# EAGLE design LEDARRAYLOW (EAGLE 8.6.0)
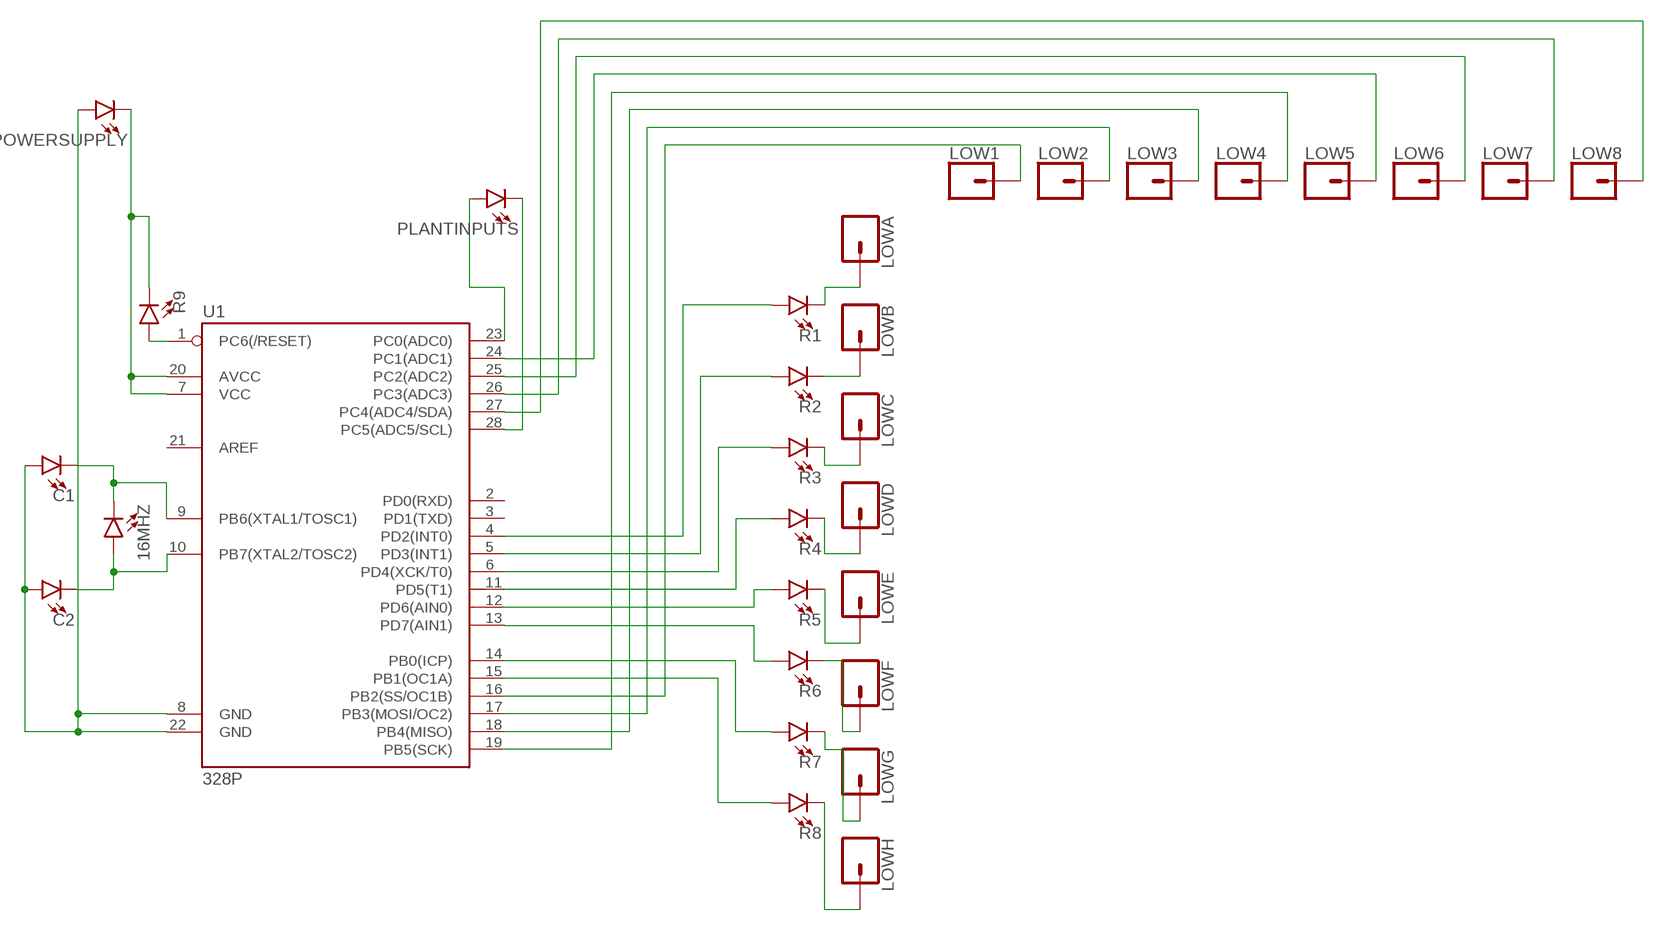
[diagram p0: schematic, sheet 1]

## Parts
16MHZ  LED3MM  [LED_3MM]
C1  LED3MM  [LED_3MM]
C2  LED3MM  [LED_3MM]
LOW1  CONN_01PTH_NO_SILK_KIT  [1X01NS_KIT]
LOW2  CONN_01PTH_NO_SILK_KIT  [1X01NS_KIT]
LOW3  CONN_01PTH_NO_SILK_KIT  [1X01NS_KIT]
LOW4  CONN_01PTH_NO_SILK_KIT  [1X01NS_KIT]
LOW5  CONN_01PTH_NO_SILK_KIT  [1X01NS_KIT]
LOW6  CONN_01PTH_NO_SILK_KIT  [1X01NS_KIT]
LOW7  CONN_01PTH_NO_SILK_KIT  [1X01NS_KIT]
LOW8  CONN_01PTH_NO_SILK_KIT  [1X01NS_KIT]
LOWA  CONN_01PTH_NO_SILK_KIT  [1X01NS_KIT]
LOWB  CONN_01PTH_NO_SILK_KIT  [1X01NS_KIT]
LOWC  CONN_01PTH_NO_SILK_KIT  [1X01NS_KIT]
LOWD  CONN_01PTH_NO_SILK_KIT  [1X01NS_KIT]
LOWE  CONN_01PTH_NO_SILK_KIT  [1X01NS_KIT]
LOWF  CONN_01PTH_NO_SILK_KIT  [1X01NS_KIT]
LOWG  CONN_01PTH_NO_SILK_KIT  [1X01NS_KIT]
LOWH  CONN_01PTH_NO_SILK_KIT  [1X01NS_KIT]
PLANTINPUTS  LED3MM  [LED_3MM]
POWERSUPPLY  LED3MM  [LED_3MM]
R1  LED3MM  [LED_3MM]
R2  LED3MM  [LED_3MM]
R3  LED3MM  [LED_3MM]
R4  LED3MM  [LED_3MM]
R5  LED3MM  [LED_3MM]
R6  LED3MM  [LED_3MM]
R7  LED3MM  [LED_3MM]
R8  LED3MM  [LED_3MM]
R9  LED3MM  [LED_3MM]
U1  328P  ATMEGA328P_PDIP  [DIP28]

## Nets
LEDD1: LOW1.1 U1.16(PB2(SS/OC1B))
N$1: R8.A U1.15(PB1(OC1A))
N$6: LOWD.1 R4.K(C)
N$7: R6.A U1.13(PD7(AIN1))
N$8: LOW6.1 U1.25(PC2(ADC2))
N$9: LOW2.1 U1.17(PB3(MOSI/OC2))
N$10: R7.A U1.14(PB0(ICP))
N$11: LOW3.1 U1.18(PB4(MISO))
N$13: PLANTINPUTS.A U1.23(PC0(ADC0))
N$14: LOW5.1 U1.24(PC1(ADC1))
N$16: 16MHZ.K(C) C1.K(C) U1.9(PB6(XTAL1/TOSC1))
N$17: R9.A U1.1(PC6(/RESET))
N$18: R5.A U1.12(PD6(AIN0))
N$19: R4.A U1.11(PD5(T1))
N$20: LOW7.1 U1.26(PC3(ADC3))
N$22: LOW8.1 U1.27(PC4(ADC4/SDA))
N$23: R2.A U1.5(PD3(INT1))
N$24: R1.A U1.4(PD2(INT0))
N$25: PLANTINPUTS.K(C) U1.28(PC5(ADC5/SCL))
N$26: POWERSUPPLY.K(C) R9.K(C) U1.7(VCC) U1.20(AVCC)
N$27: LOW4.1 U1.19(PB5(SCK))
N$28: 16MHZ.A C2.K(C) U1.10(PB7(XTAL2/TOSC2))
N$29: LOWC.1 R3.K(C)
N$30: R3.A U1.6(PD4(XCK/T0))
N$31: LOWB.1 R2.K(C)
N$33: LOWA.1 R1.K(C)
N$34: LOWE.1 R5.K(C)
N$35: LOWF.1 R6.K(C)
N$36: LOWG.1 R7.K(C)
N$37: LOWH.1 R8.K(C)
POWERSUPPLY: C1.A C2.A POWERSUPPLY.A U1.8(GND) U1.22(GND)
Unconnected: U1.2(PD0(RXD)) U1.3(PD1(TXD)) U1.21(AREF)

## Library data of the parts
16MHZ C1 C2 PLANTINPUTS POWERSUPPLY R1-R9 = SparkFun-LED:LED: LED (Generic) Standard schematic elements and footprints for 5mm, 3mm, 1206, and 0603 sized LEDs. Generic LEDs with no color specified.; PROD_ID: DIO-08794
LOW1-LOW8 LOWA LOWB LOWC LOWD LOWE LOWF LOWG LOWH = SparkFun-Connectors:CONN_01: Single connection point. Often used as Generic Header-pin footprint for 0.1 inch spaced/style header connections On any of the 0.1 inch spaced packages, you can populate with these: Break Away Headers - Straight <https://www.sparkfun.com/products/116> (PRT-00116) Break Away Male Headers - Right Angle <https://www.sparkfun.com/products/553> (PRT-00553) Female Headers <https://www.sparkfun.com/products/115> (PRT-00115) Break Away Headers - Machine Pin <https://www.sparkfun.com/products/117> (PRT-00117) Break Away Female Headers - Swiss Machine Pin <https://www.sparkfun.com/products/743> (PRT-00743) This device is also useful as a general connection point to wire up your design to another part of your project. Our various solder wires solder well into these plated through hole pads. Hook-Up Wire - Assortment (Stranded, 22 AWG) <https://www.sparkfun.com/products/11375> (PRT-11375) Hook-Up Wire - Assortment (Solid Core, 22 AWG) <https://www.sparkfun.com/products/11367> (PRT-11367) View the entire wire category on our website here <https://www.sparkfun.com/categories/141> Special notes: SMTSO-256-ET is a "flush mount" nut for a 4-40 screw. We mostly use this on specialty testbeds; it is a nice way to connect hardware to your PCB at an adjustable hieght. Also note, the SNAP packages are for using a snappable style connector. We sell a baggie of snaps and they are also used on two LilyPad designs: Snap Assortment - 30 pack (male and female) <https://www.sparkfun.com/products/11347> (DEV-11347) LilyPad Arduino SimpleSnap <https://www.sparkfun.com/products/10941> (DEV-10941) LilyPad SimpleSnap Protoboard <https://www.sparkfun.com/products/10940> (DEV-10940)
U1 = SparkFun-IC-Microcontroller:ATMEGA328P_PDIP: Atmel 328P Through hole ATMEGA328P uC used in the Arduino 32kb flash, 1k EEPROM, 2k SRAM Datasheet <http://www.sparkfun.com/datasheets/Components/SMD/ATMega328.pdf> SparkFun Products Storefront component: AVR 28 Pin 20MHz 32K 6A/D - ATMega328P <https://www.sparkfun.com/products/9061> (COM-09061) SparkFun Simon Says - Through-Hole Soldering Kit <https://www.sparkfun.com/products/10547> (KIT-10547) SparkFun Learn to Solder - Simon Says <https://www.sparkfun.com/products/13708> (KIT-13708) SparkFun BigTime Watch Kit <https://www.sparkfun.com/products/11734> (KIT-11734) SparkFun ClockIt <https://www.sparkfun.com/products/10930> (KIT-10930) SparkFun Serial Enabled LCD Kit <https://www.sparkfun.com/products/10097> (LCD-10097) SparkFun Simon Tilts - Through Hole Soldering Kit <https://www.sparkfun.com/products/12634> (KIT-12634) SparkFun Frequency Counter Kit <https://www.sparkfun.com/products/10140> (KIT-10140) FabFM Radio Kit <https://www.sparkfun.com/products/11043> (KIT-11043) SparkFun Binary Blaster Kit <https://www.sparkfun.com/products/12037> (KIT-12037) SparkFun Metro-Gnome <https://www.sparkfun.com/products/9236> (KIT-09236) ATmega328 with Arduino Optiboot (Uno) <https://www.sparkfun.com/products/10524> (DEV-10524); PROD_ID: IC-09136

## Board
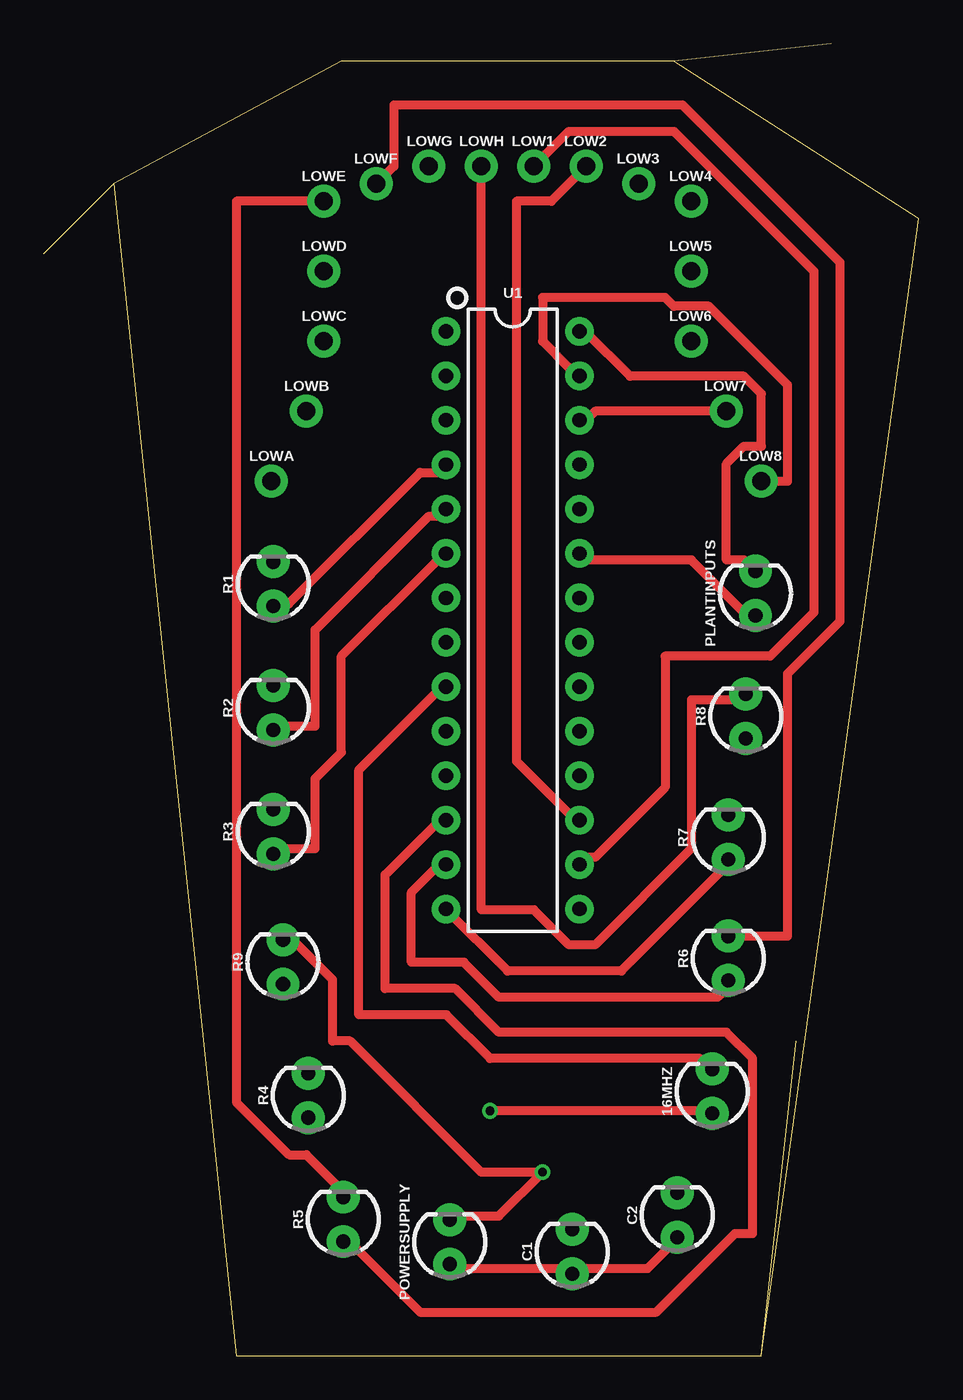
[diagram p1: board, top side]
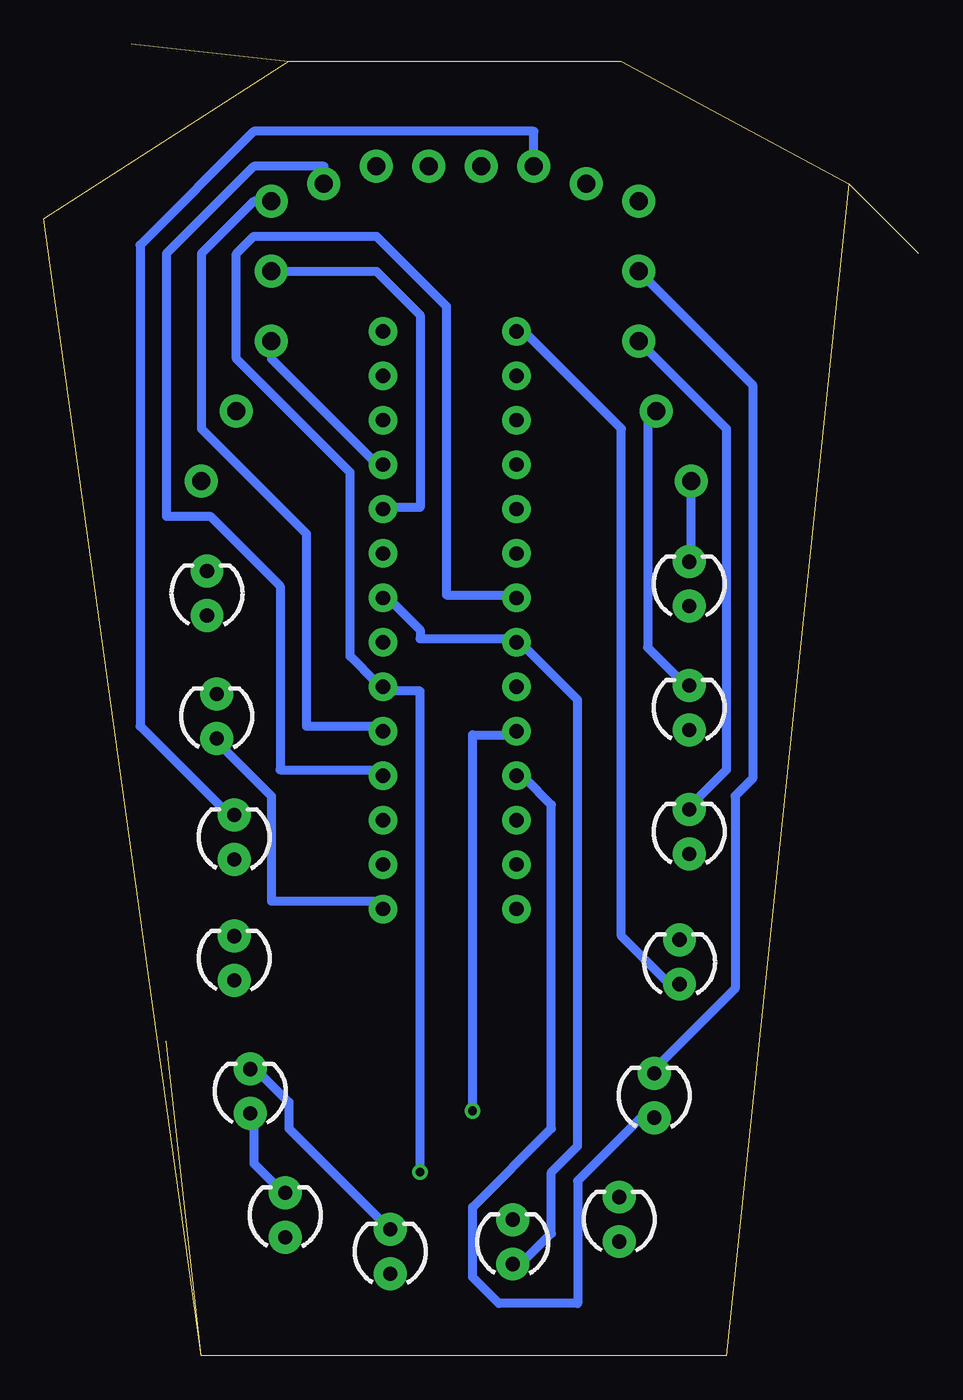
[diagram p2: board, bottom side, seen from below]

Size 50 x 75 mm. Coordinates in mm from the lower left corner, seen from the top.
Outline: 41,0 50,65 36,74
Outline: 45,75 36,74
Outline: 36,74 17,74 4,67
Outline: 0,63 4,67
Outline: 4,67 11,0 41,0
Outline: 41,0 43,18
Copper layers (1*16): Top 0.035mm / dielectric 1.5mm / Bottom 0.035mm
Design rules "default *": minimum track width 0.5mm, minimum drill 0.5mm, track to track 0.8mm, track to pad 0.8mm, pad to pad 0.6mm, via to via 2mm, smd to smd 1mm, copper to edge 40mil, drill to drill 6mil, minimum pad ring 10mil, minimum via ring 8mil, stop-mask expansion 4mil, vias tented up to drill 0mil, thermal gap 10mil

### Footprints (pad centres in the part's own frame; a part is rotated, then mirrored left to right if it is on the bottom)
LED_3MM = drill 0.813 pad 1.88: A -1.27,0; K 1.27,0
1X01NS_KIT = drill 1.016 pad 1.88: 1 0,0
DIP28 = drill 0.813 pad 1.626: 1 -16.51,-3.81; 2 -13.97,-3.81; 3 -11.43,-3.81; 4 -8.89,-3.81; 5 -6.35,-3.81; 6 -3.81,-3.81; 7 -1.27,-3.81; 8 1.27,-3.81; 9 3.81,-3.81; 10 6.35,-3.81; 11 8.89,-3.81; 12 11.43,-3.81; 13 13.97,-3.81; 14 16.51,-3.81; 15 16.51,3.81; 16 13.97,3.81; 17 11.43,3.81; 18 8.89,3.81; 19 6.35,3.81; 20 3.81,3.81; 21 1.27,3.81; 22 -1.27,3.81; 23 -3.81,3.81; 24 -6.35,3.81; 25 -8.89,3.81; 26 -11.43,3.81; 27 -13.97,3.81; 28 -16.51,3.81

### Placement (x,y rotation side)
16MHZ  38.2,15.12 90 top
C1  30.2,5.96 90 top
C2  36.2,8.04 90 top
LOW1  28,68 0 top
LOW2  31,68 0 top
LOW3  34,67 0 top
LOW4  37,66 0 top
LOW5  37,62 0 top
LOW6  37,58 0 top
LOW7  39,54 0 top
LOW8  41,50 0 top
LOWA  13,50 0 top
LOWB  15,54 0 top
LOWC  16,58 0 top
LOWD  16,62 0 top
LOWE  16,66 0 top
LOWF  19,67 0 top
LOWG  22,68 0 top
LOWH  25,68 0 top
PLANTINPUTS  40.67,43.59 90 top
POWERSUPPLY  23.2,6.51 90 top
R1  13.12,44.12 90 top
R2  13.12,37.04 90 top
R3  13.12,29.96 90 top
R4  15.12,14.88 90 top
R5  17.12,7.8 90 top
R6  39.12,22.72 90 top
R7  39.12,29.64 90 top
R8  40.12,36.56 90 top
R9  13.67,22.51 90 top
U1  26.8,42.05 270 top

### Tracks (layer width: path | path; a pad name or v marks a point on that pad's centre or on a via)
LEDD1
  Top 0.5: LOW1.1 30,70 36,70 44,62 44,42.5 41.5,40 35.5,40 35.5,32.5 31.5,28.5 31,28.5 U1.16
N$1
  Bottom 0.5: U1.15 31,26 37,26 37,32 40,35 R8.A
N$6
  Bottom 0.5: LOWD.1 9.5,55.5 9.5,33 10.5,32 10.5,21 15,16.5 R4.K
N$7
  Top 0.5: U1.13 22.5,28 21,26.5 21,22.5 24,22.5 26,20.5 38.5,20.5 39,21 R6.A
N$8
  Bottom 0.5: LOW6.1 37,57 31,51 U1.25
N$9
  Top 0.5: LOW2.1 29,66 27,66 27,34 30,31 30.5,31 U1.17
N$10
  Top 0.5: U1.14 23,25.5 26.5,22 33,22 39,28 R7.A
N$11
  Bottom 0.5: LOW3.1 34,68 38,68 43,63 43,48 40.5,48 36.5,44 36.5,33.5 31,33.5 U1.18
N$13
  Top 0.5: U1.23 31,45.5 37,45.5 40,42.5 40.5,42.5 PLANTINPUTS.A
N$14
  Bottom 0.5: LOW5.1 31,62 28.5,59.5 28.5,48.5 30.5,48.5 U1.24
N$16
  Top 0.5: U1.9 22.5,38 18,33.5 18,19.5 23,19.5 25.5,17 37.5,17 38,16.5 16MHZ.K
  Bottom 0.5: C1.K 30.5,7.5 36,13 36,14.5 38,16.5 16MHZ.K
N$17
  Bottom 0.5: U1.1 22.5,58.5 17,53 17,24 14,21 R9.A
N$18
  Top 0.5: U1.12 22.5,30.5 19.5,27.5 19.5,21 23.5,21 26,18.5 39,18.5 40.5,17 40.5,7 39.5,7 35,2.5 21.5,2.5 17.5,6.5 R5.A
N$19
  Bottom 0.5: U1.11 22.5,33 21,31.5 21,13 25.5,8.5 25.5,4.5 24,3 19.5,3 19.5,10 15.5,14 R4.A
N$20
  Top 0.5: LOW7.1 31.5,54 31,53.5 U1.26
N$22
  Top 0.5: LOW8.1 42.5,50 42.5,55.5 38,60 36,60 35.5,60.5 28.5,60.5 28.5,58 30,56.5 30.5,56.5 U1.27
N$23
  Top 0.5: U1.5 22.5,48 22,48 15.5,41.5 15.5,36 13.5,36 R2.A
N$24
  Top 0.5: U1.4 22.5,50.5 21.5,50.5 14,43 13.5,43 R1.A
N$25
  Top 0.5: U1.28 31,58.5 33.5,56 40,56 41,55 41,52 40,52 39,51 39,45.5 40,45.5 40.5,45 PLANTINPUTS.K
N$26  (via drill 0.5)
  Top 0.5: POWERSUPPLY.K 23.5,8 26,8 v28.5,10.5 25,10.5 17.5,18 16.5,18 16.5,21.5 14.5,23.5 14,23.5 R9.K
  Bottom 0.5: v28.5,10.5 28.5,38 30.5,38 U1.20 31,38.5 32.5,40 32.5,50.5 39,57 39,63 38,64 31,64 27,60 27,43.5 23,43.5 U1.7
N$27
  Bottom 0.5: LOW4.1 38,66 41,63 41,53 35,47 35,36 31,36 U1.19
N$28  (via drill 0.5)
  Top 0.5: v25.5,14 38,14 16MHZ.A
  Bottom 0.5: v25.5,14 25.5,35.5 23,35.5 U1.10 | C2.K 36.5,9.5 38,11 38,13.5 16MHZ.A
N$29
  Bottom 0.5: LOWC.1 11,53 11,33.5 13,31.5 R3.K
N$30
  Top 0.5: U1.6 22.5,45.5 17,40 17,34.5 15.5,33 15.5,29 13.5,29 R3.A
N$31
  Bottom 0.5: LOWB.1 15.5,53.5 15.5,40.5 13.5,38.5 R2.K
N$33
  Bottom 0.5: LOWA.1 13,45.5 R1.K
N$34
  Top 0.5: LOWE.1 11,66 11,14.5 14,11.5 15,11.5 17,9.5 R5.K
N$35
  Top 0.5: LOWF.1 20,68 20,71.5 36.5,71.5 45.5,62.5 45.5,42 42.5,39 42.5,24 39.5,24 R6.K
N$36
  Bottom 0.5: LOWG.1 22,70 38,70 44.5,63.5 44.5,36 39.5,31 R7.K
N$37
  Top 0.5: LOWH.1 25,25.5 28,25.5 30,23.5 31.5,23.5 37,29 37,37.5 40,37.5 R8.K
POWERSUPPLY
  Top 0.5: POWERSUPPLY.A 23.5,5 30,5 C1.A 30.5,5 34.5,5 36,6.5 C2.A
  Bottom 0.5: U1.22 30.5,43.5 28.5,41.5 28.5,41 23,41 U1.8 22.5,40.5 19.5,37.5 19.5,12 21,10.5 21,7 23,5 POWERSUPPLY.A